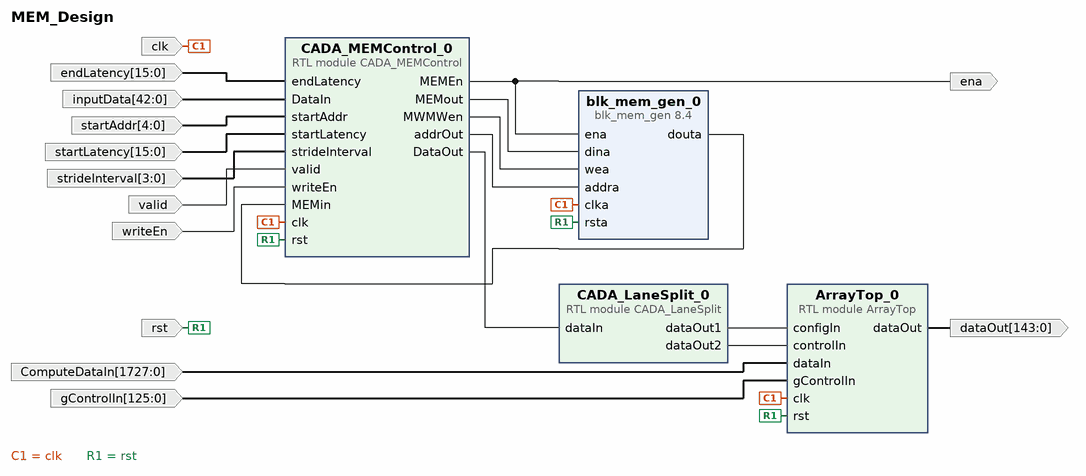
[diagram p0: block diagram of the top level]
# Vivado block design MEM_Design, xc7z020clg400-2, Vivado 2023.2
create_bd_design MEM_Design

create_bd_port -dir I clk
create_bd_port -dir I rst
create_bd_port -dir I valid
create_bd_port -dir I writeEn
create_bd_port -dir I -from 4 -to 0 startAddr
create_bd_port -dir I -from 3 -to 0 strideInterval
create_bd_port -dir I -from 15 -to 0 endLatency
create_bd_port -dir I -from 15 -to 0 startLatency
create_bd_port -dir O ena
create_bd_port -dir I -from 42 -to 0 inputData
create_bd_port -dir I -from 1727 -to 0 ComputeDataIn
create_bd_port -dir I -from 125 -to 0 gControlIn
create_bd_port -dir O -from 143 -to 0 dataOut

create_bd_cell -type ip -vlnv xilinx.com:ip:blk_mem_gen:8.4 blk_mem_gen_0
set_property -dict [list \
  CONFIG.Memory_Type Single_Port_RAM \
  CONFIG.Use_RSTA_Pin true \
  CONFIG.Write_Depth_A 32 \
  CONFIG.Write_Width_A 43 \
  CONFIG.use_bram_block Stand_Alone \
] [get_bd_cells blk_mem_gen_0]
create_bd_cell -type module -reference CADA_MEMControl CADA_MEMControl_0
create_bd_cell -type module -reference ArrayTop ArrayTop_0
create_bd_cell -type module -reference CADA_LaneSplit CADA_LaneSplit_0

# ---- connections ----

connect_bd_net [get_bd_pins ArrayTop_0/dataOut] [get_bd_ports dataOut]
connect_bd_net [get_bd_pins CADA_LaneSplit_0/dataOut1] [get_bd_pins ArrayTop_0/configIn]
connect_bd_net [get_bd_pins CADA_LaneSplit_0/dataOut2] [get_bd_pins ArrayTop_0/controlIn]
connect_bd_net [get_bd_pins CADA_MEMControl_0/DataOut] [get_bd_pins CADA_LaneSplit_0/dataIn]
connect_bd_net [get_bd_pins CADA_MEMControl_0/MEMEn] [get_bd_pins blk_mem_gen_0/ena] [get_bd_ports ena]
connect_bd_net [get_bd_pins CADA_MEMControl_0/MEMout] [get_bd_pins blk_mem_gen_0/dina]
connect_bd_net [get_bd_pins CADA_MEMControl_0/MWMWen] [get_bd_pins blk_mem_gen_0/wea]
connect_bd_net [get_bd_pins CADA_MEMControl_0/addrOut] [get_bd_pins blk_mem_gen_0/addra]
connect_bd_net [get_bd_ports ComputeDataIn] [get_bd_pins ArrayTop_0/dataIn]
connect_bd_net [get_bd_pins blk_mem_gen_0/douta] [get_bd_pins CADA_MEMControl_0/MEMin]
connect_bd_net [get_bd_ports clk] [get_bd_pins CADA_MEMControl_0/clk] [get_bd_pins blk_mem_gen_0/clka] [get_bd_pins ArrayTop_0/clk]
connect_bd_net [get_bd_ports endLatency] [get_bd_pins CADA_MEMControl_0/endLatency]
connect_bd_net [get_bd_ports gControlIn] [get_bd_pins ArrayTop_0/gControlIn]
connect_bd_net [get_bd_ports inputData] [get_bd_pins CADA_MEMControl_0/DataIn]
connect_bd_net [get_bd_ports rst] [get_bd_pins CADA_MEMControl_0/rst] [get_bd_pins blk_mem_gen_0/rsta] [get_bd_pins ArrayTop_0/rst]
connect_bd_net [get_bd_ports startAddr] [get_bd_pins CADA_MEMControl_0/startAddr]
connect_bd_net [get_bd_ports startLatency] [get_bd_pins CADA_MEMControl_0/startLatency]
connect_bd_net [get_bd_ports strideInterval] [get_bd_pins CADA_MEMControl_0/strideInterval]
connect_bd_net [get_bd_ports valid] [get_bd_pins CADA_MEMControl_0/valid]
connect_bd_net [get_bd_ports writeEn] [get_bd_pins CADA_MEMControl_0/writeEn]

validate_bd_design
save_bd_design
